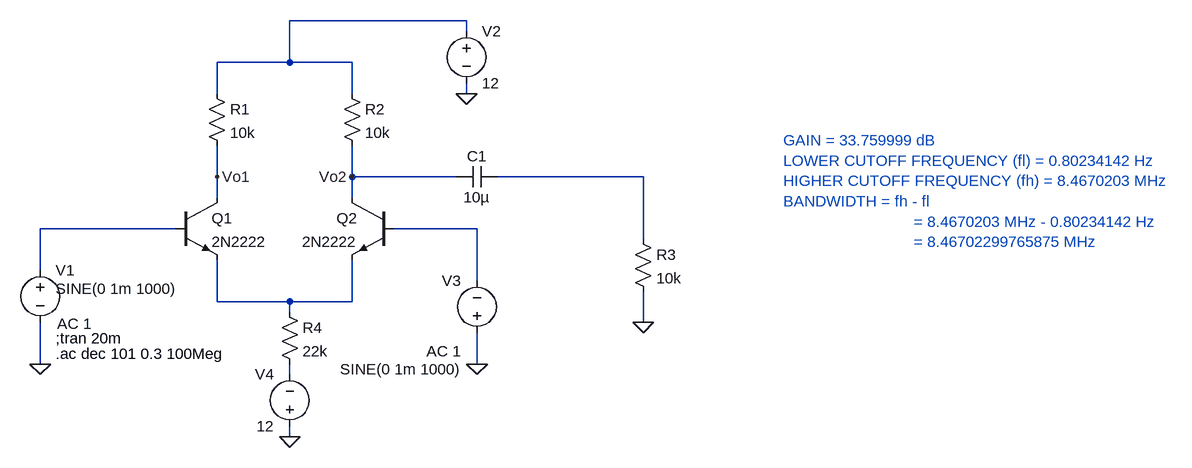
[diagram p0: schematic DIFFERENTIAL AMPLIFIER WITH RESISTIVE LOAD.asc]
DIFFERENTIAL AMPLIFIER WITH RESISTIVE LOAD.asc, the LTspice schematic file:
Version 4
SHEET 1 1612 680
WIRE 512 -160 240 -160
WIRE 512 -144 512 -160
WIRE 240 -96 240 -160
WIRE 240 -96 128 -96
WIRE 336 -96 240 -96
WIRE 128 -48 128 -96
WIRE 336 -48 336 -96
WIRE 512 -48 512 -64
WIRE 128 80 128 32
WIRE 336 80 336 32
WIRE 496 80 336 80
WIRE 784 80 560 80
WIRE 128 112 128 80
WIRE 336 112 336 80
WIRE 64 160 -144 160
WIRE 528 160 400 160
WIRE 784 176 784 80
WIRE -144 224 -144 160
WIRE 528 240 528 160
WIRE 128 272 128 208
WIRE 240 272 128 272
WIRE 336 272 336 208
WIRE 336 272 240 272
WIRE 240 288 240 272
WIRE 784 304 784 256
WIRE -144 368 -144 304
WIRE 528 368 528 320
WIRE 240 384 240 368
WIRE 240 480 240 464
FLAG 784 304 0
FLAG 528 368 0
FLAG 512 -48 0
FLAG -144 368 0
FLAG 240 480 0
FLAG 128 80 Vo1
FLAG 336 80 Vo2
SYMBOL npn 64 112 R0
SYMATTR InstName Q1
SYMATTR Value 2N2222
SYMBOL npn 400 112 M0
SYMATTR InstName Q2
SYMATTR Value 2N2222
SYMBOL res 112 -64 R0
SYMATTR InstName R1
SYMATTR Value 10k
SYMBOL res 320 -64 R0
SYMATTR InstName R2
SYMATTR Value 10k
SYMBOL res 768 160 R0
SYMATTR InstName R3
SYMATTR Value 10k
SYMBOL res 224 272 R0
SYMATTR InstName R4
SYMATTR Value 22k
SYMBOL voltage 512 -160 R0
WINDOW 123 0 0 Left 0
WINDOW 39 0 0 Left 0
SYMATTR InstName V2
SYMATTR Value 12
SYMBOL voltage 240 480 R180
WINDOW 0 24 96 Left 2
WINDOW 3 24 16 Left 2
WINDOW 123 0 0 Left 0
WINDOW 39 0 0 Left 0
SYMATTR InstName V4
SYMATTR Value 12
SYMBOL cap 560 64 R90
WINDOW 0 0 32 VBottom 2
WINDOW 3 32 32 VTop 2
SYMATTR InstName C1
SYMATTR Value 10µ
SYMBOL voltage -144 208 R0
WINDOW 123 26 98 Left 2
WINDOW 39 0 0 Left 0
WINDOW 3 24 44 Left 2
SYMATTR Value2 AC 1
SYMATTR InstName V1
SYMATTR Value SINE(0 1m 1000)
SYMBOL voltage 528 336 R180
WINDOW 0 24 96 Left 2
WINDOW 3 24 -40 Left 2
WINDOW 123 24 -12 Left 2
WINDOW 39 0 0 Left 0
SYMATTR InstName V3
SYMATTR Value SINE(0 1m 1000)
SYMATTR Value2 AC 1
TEXT -120 328 Left 2 !;tran 20m
TEXT -120 352 Left 2 !.ac dec 101 0.3 100Meg
TEXT 1000 24 Left 2 ;GAIN = 33.759999 dB\nLOWER CUTOFF FREQUENCY (fl) = 0.80234142 Hz\nHIGHER CUTOFF FREQUENCY (fh) = 8.4670203 MHz\nBANDWIDTH = fh - fl\n                             = 8.4670203 MHz - 0.80234142 Hz\n                             = 8.46702299765875 MHz

The netlist it stands for:
* DIFFERENTIAL AMPLIFIER WITH RESISTIVE LOAD.asc
Q1 Vo1 N003 N005 0 2N2222
Q2 Vo2 N004 N005 0 2N2222
R1 N001 Vo1 10k
R2 N001 Vo2 10k
R3 N002 0 10k
R4 N005 N006 22k
V2 N001 0 12
V4 0 N006 12
C1 N002 Vo2 10µ
V1 N003 0 SINE(0 1m 1000) AC 1
V3 0 N004 SINE(0 1m 1000) AC 1
.model NPN NPN
.model PNP PNP
.lib standard.bjt
;tran 20m
.ac dec 101 0.3 100Meg
* GAIN = 33.759999 dB
* LOWER CUTOFF FREQUENCY (fl) = 0.80234142 Hz
* HIGHER CUTOFF FREQUENCY (fh) = 8.4670203 MHz
* BANDWIDTH = fh - fl
*                              = 8.4670203 MHz - 0.80234142 Hz
*                              = 8.46702299765875 MHz
.backanno
.end